# EAGLE design SolarCellX (EAGLE 9.2.2)
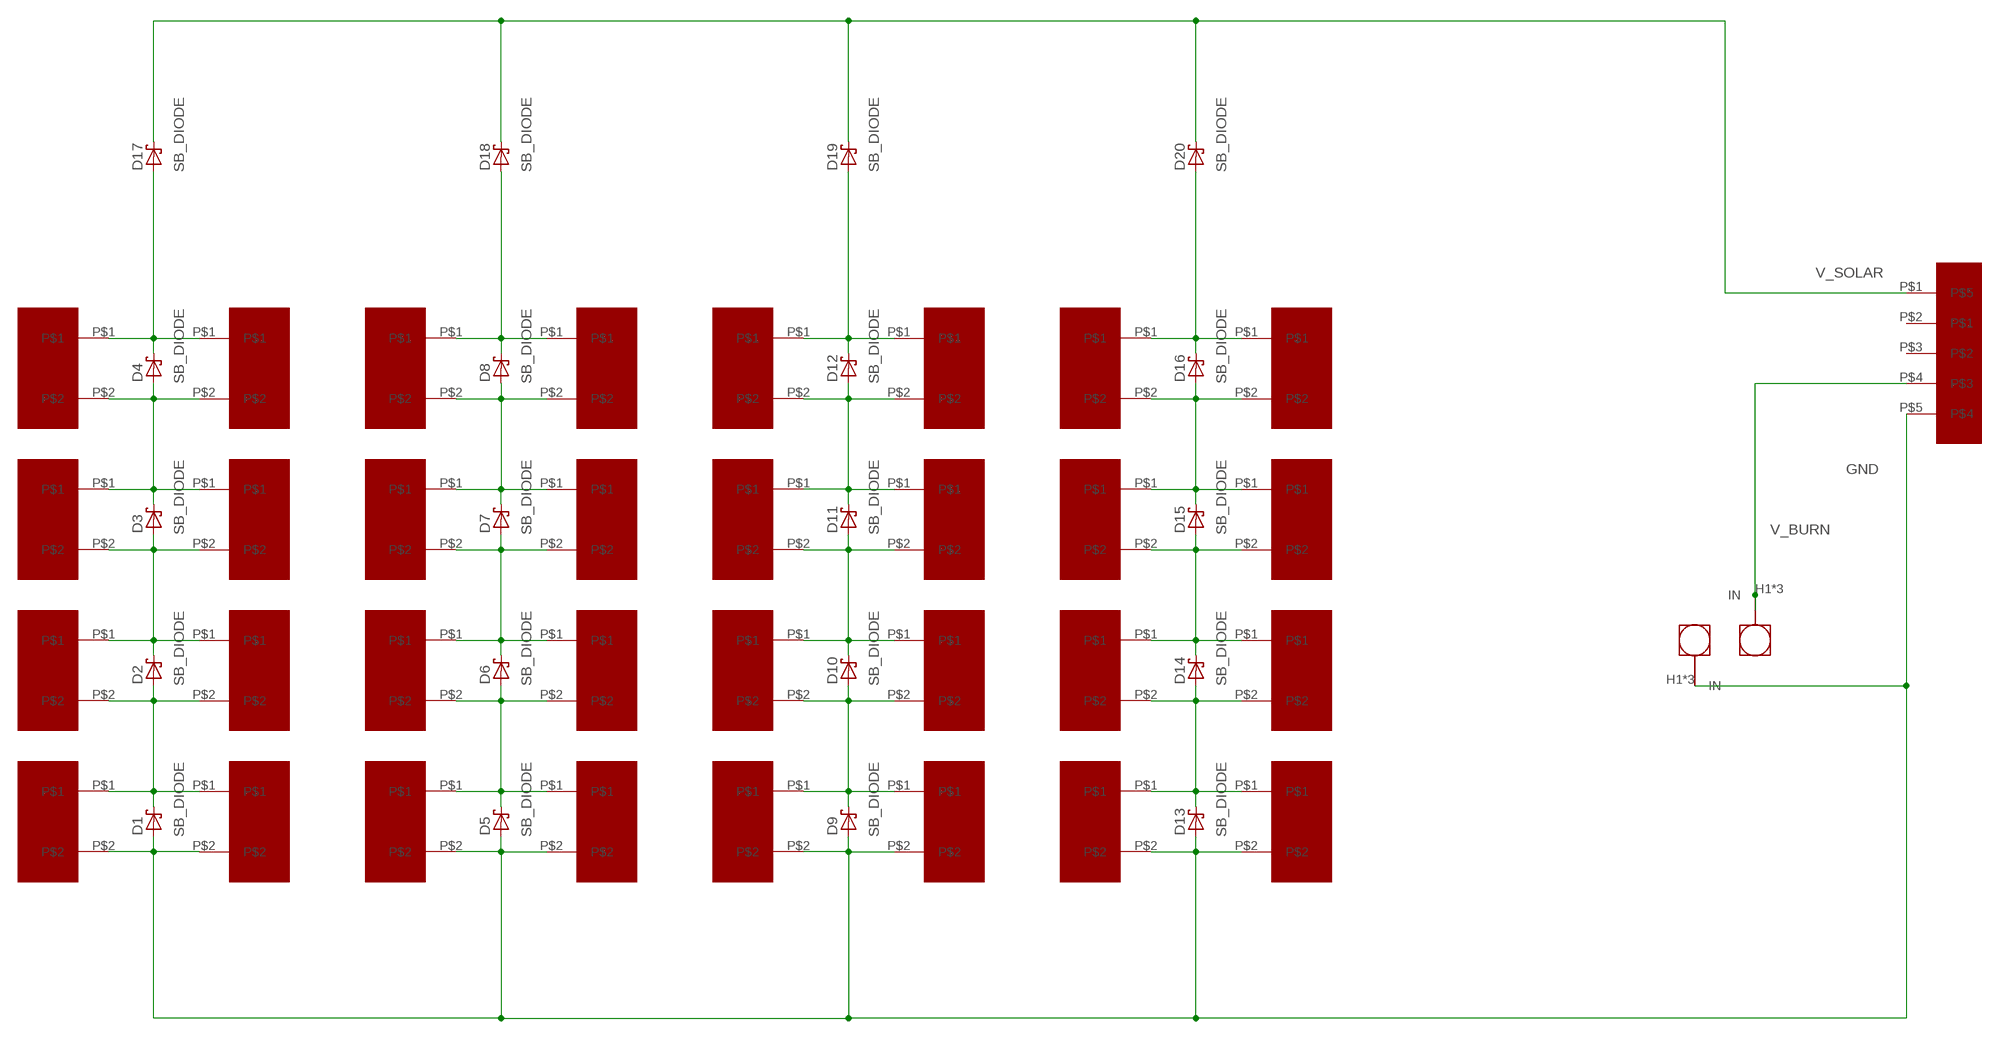
[diagram p0: schematic, sheet 1]

## Parts
11  KXOB22-04X3F  [KXOB22-04X3F]
12  KXOB22-04X3F  [KXOB22-04X3F]
13  KXOB22-04X3F  [KXOB22-04X3F]
14  KXOB22-04X3F  [KXOB22-04X3F]
15  KXOB22-04X3F  [KXOB22-04X3F]
16  KXOB22-04X3F  [KXOB22-04X3F]
17  KXOB22-04X3F  [KXOB22-04X3F]
18  KXOB22-04X3F  [KXOB22-04X3F]
21  KXOB22-04X3F  [KXOB22-04X3F]
22  KXOB22-04X3F  [KXOB22-04X3F]
23  KXOB22-04X3F  [KXOB22-04X3F]
24  KXOB22-04X3F  [KXOB22-04X3F]
25  KXOB22-04X3F  [KXOB22-04X3F]
26  KXOB22-04X3F  [KXOB22-04X3F]
27  KXOB22-04X3F  [KXOB22-04X3F]
28  KXOB22-04X3F  [KXOB22-04X3F]
31  KXOB22-04X3F  [KXOB22-04X3F]
32  KXOB22-04X3F  [KXOB22-04X3F]
33  KXOB22-04X3F  [KXOB22-04X3F]
34  KXOB22-04X3F  [KXOB22-04X3F]
35  KXOB22-04X3F  [KXOB22-04X3F]
36  KXOB22-04X3F  [KXOB22-04X3F]
37  KXOB22-04X3F  [KXOB22-04X3F]
38  KXOB22-04X3F  [KXOB22-04X3F]
41  KXOB22-04X3F  [KXOB22-04X3F]
42  KXOB22-04X3F  [KXOB22-04X3F]
43  KXOB22-04X3F  [KXOB22-04X3F]
44  KXOB22-04X3F  [KXOB22-04X3F]
45  KXOB22-04X3F  [KXOB22-04X3F]
46  KXOB22-04X3F  [KXOB22-04X3F]
47  KXOB22-04X3F  [KXOB22-04X3F]
48  KXOB22-04X3F  [KXOB22-04X3F]
D1  SB_DIODE  [SB_DIODE]
D2  SB_DIODE  [SB_DIODE]
D3  SB_DIODE  [SB_DIODE]
D4  SB_DIODE  [SB_DIODE]
D5  SB_DIODE  [SB_DIODE]
D6  SB_DIODE  [SB_DIODE]
D7  SB_DIODE  [SB_DIODE]
D8  SB_DIODE  [SB_DIODE]
D9  SB_DIODE  [SB_DIODE]
D10  SB_DIODE  [SB_DIODE]
D11  SB_DIODE  [SB_DIODE]
D12  SB_DIODE  [SB_DIODE]
D13  SB_DIODE  [SB_DIODE]
D14  SB_DIODE  [SB_DIODE]
D15  SB_DIODE  [SB_DIODE]
D16  SB_DIODE  [SB_DIODE]
D17  SB_DIODE  [SB_DIODE]
D18  SB_DIODE  [SB_DIODE]
D19  SB_DIODE  [SB_DIODE]
D20  SB_DIODE  [SB_DIODE]
U$33  B5B-EH-A(LF)(SN)  [B5B-EH-A(LF)(SN)]
U$34  BURNER  [BURNER]
U$35  BURNER  [BURNER]

## Nets
GND: 11.P$2 12.P$2 21.P$2 22.P$2 31.P$2 32.P$2 41.P$2 42.P$2 D1.POS D5.POS D9.POS D13.POS U$33.P$5 U$35.H1(IN) U$35.H2(IN) U$35.H3(IN)
N$2: 11.P$1 12.P$1 13.P$2 14.P$2 D1.NEG D2.POS
N$4: 13.P$1 14.P$1 15.P$2 16.P$2 D2.NEG D3.POS
N$6: 15.P$1 16.P$1 17.P$2 18.P$2 D3.NEG D4.POS
N$8: 17.P$1 18.P$1 D4.NEG D17.POS
N$9: 23.P$1 24.P$1 25.P$2 26.P$2 D6.NEG D7.POS
N$10: 21.P$1 22.P$1 23.P$2 24.P$2 D5.NEG D6.POS
N$14: 25.P$1 26.P$1 27.P$2 28.P$2 D7.NEG D8.POS
N$16: 27.P$1 28.P$1 D8.NEG D18.POS
N$18: 31.P$1 32.P$1 33.P$2 34.P$2 D9.NEG D10.POS
N$20: 33.P$1 34.P$1 35.P$2 36.P$2 D10.NEG D11.POS
N$22: 35.P$1 36.P$1 37.P$2 38.P$2 D11.NEG D12.POS
N$24: 37.P$1 38.P$1 D12.NEG D19.POS
N$26: 41.P$1 42.P$1 43.P$2 44.P$2 D13.NEG D14.POS
N$28: 43.P$1 44.P$1 45.P$2 46.P$2 D14.NEG D15.POS
N$30: 45.P$1 46.P$1 47.P$2 48.P$2 D15.NEG D16.POS
N$32: 47.P$1 48.P$1 D16.NEG D20.POS
V_BURN: U$33.P$4 U$34.H1(IN) U$34.H2(IN) U$34.H3(IN)
V_SOLAR: D17.NEG D18.NEG D19.NEG D20.NEG U$33.P$1
Unconnected: U$33.P$2 U$33.P$3

## Library data of the parts
11-18 21-28 31-38 41-48 = Solar:KXOB22-04X3F
D1-D20 = Solar:SB_DIODE
U$33 = Solar:B5B-EH-A(LF)(SN)
U$34 U$35 = Burner:BURNER

## Board
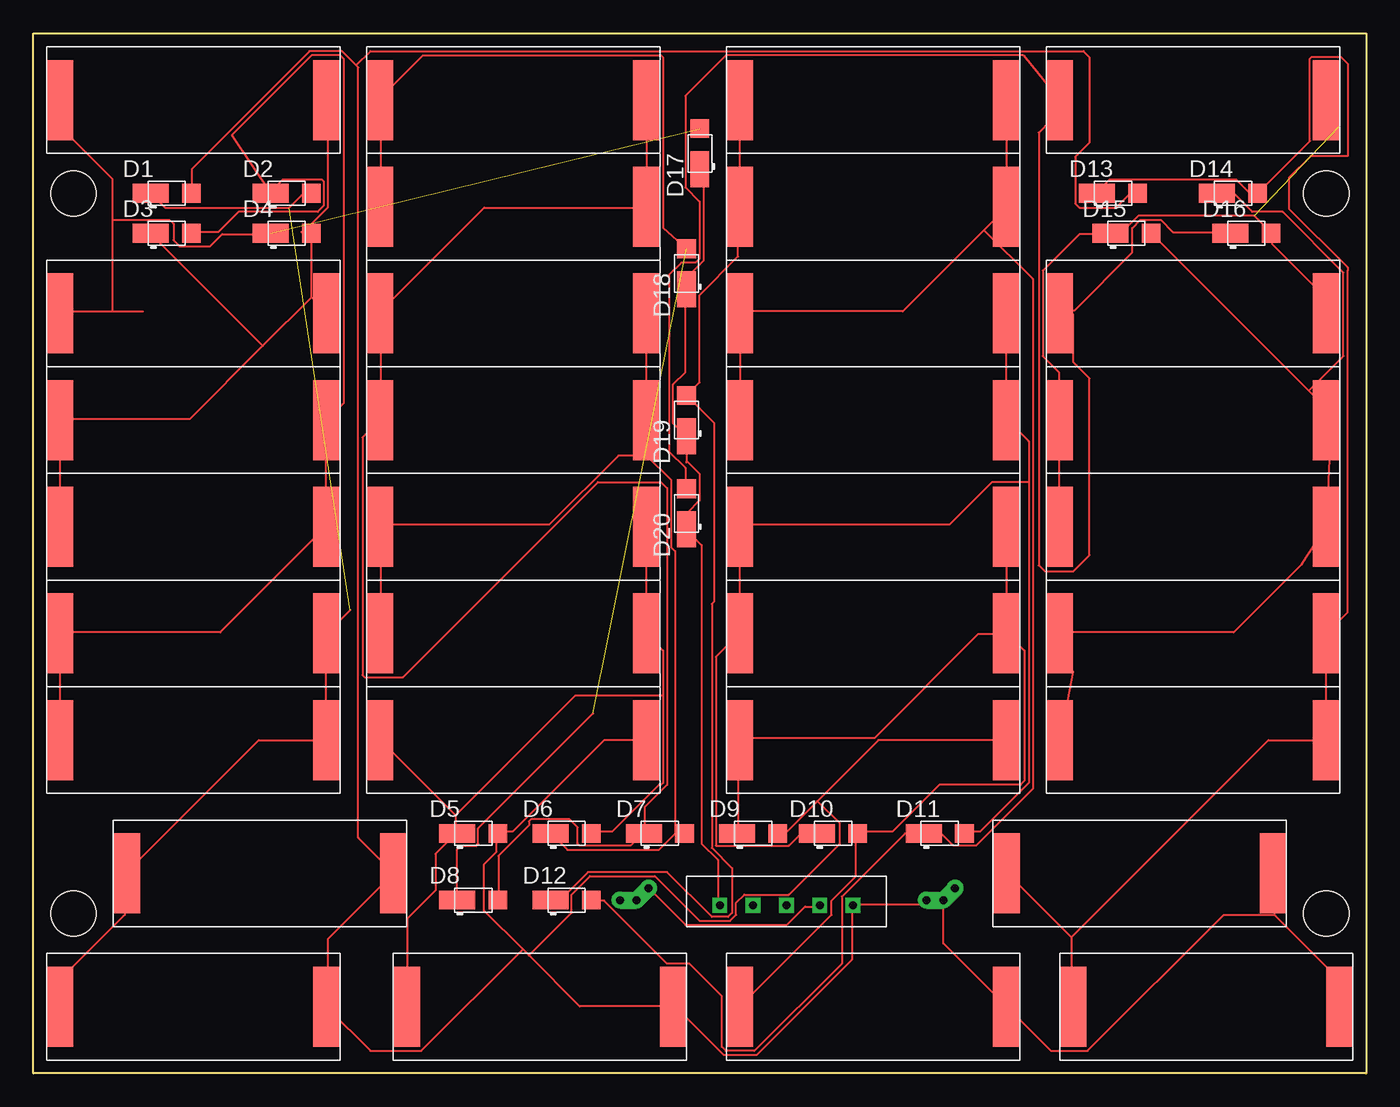
[diagram p1: board, top side]

Size 100 x 78 mm. Coordinates in mm from the lower left corner, seen from the top.
Outline: 0,0 0,78 100,78 100,0 0,0
Copper layers (1+2*15+16): Top 0.035mm / dielectric 1.5mm / Route2 0.035mm / dielectric 0.15mm / Route15 0.035mm / dielectric 0.2mm / Bottom 0.035mm
Design rules "default *": minimum track width 6mil, minimum drill 0.35mm, track to track 6mil, track to pad 6mil, pad to pad 6mil, via to via 6mil, smd to smd 6mil, copper to edge 40mil, drill to drill 6mil, minimum pad ring 10mil, minimum via ring 8mil, stop-mask expansion 4mil, vias tented up to drill 0mil, thermal gap 10mil
Holes 3.4 mm at 3,12 3,66 97,12 97,66

### Footprints (pad centres in the part's own frame; a part is rotated, then mirrored left to right if it is on the bottom)
KXOB22-04X3F = smd 2 x 6: P$1 1,4; P$2 21,4
SB_DIODE = smd 2.7 x 1.4: NEG -1.2,0 | smd 1.4 x 1.4: POS 1.85,0
B5B-EH-A(LF)(SN) = drill 0.6 square: P$1 2.5,1.6; P$2 5,1.6; P$3 7.5,1.6; P$4 10,1.6; P$5 12.5,1.6
BURNER = drill 0.6 pad 1.27 offset: H1 0,0; H2 1.27,0 | drill 0.6 pad 1.27: H3 2.159,0.889

### Placement (x,y rotation side)
11  1,1 0 top
12  6,11 0 top
13  1,21 0 top
14  1,29 0 top
15  1,37 0 top
16  1,45 0 top
17  1,53 0 top
18  1,69 0 top
21  27,1 0 top
22  25,21 0 top
23  25,29 0 top
24  25,37 0 top
25  25,45 0 top
26  25,53 0 top
27  25,61 0 top
28  25,69 0 top
31  52,1 0 top
32  52,21 0 top
33  52,29 0 top
34  52,37 0 top
35  52,45 0 top
36  52,53 0 top
37  52,61 0 top
38  52,69 0 top
41  77,1 0 top
42  72,11 0 top
43  76,21 0 top
44  76,29 0 top
45  76,37 0 top
46  76,45 0 top
47  76,53 0 top
48  76,69 0 top
D1  10,66 0 top
D2  19,66 0 top
D3  10,63 0 top
D4  19,63 0 top
D5  33,18 0 top
D6  40,18 0 top
D7  47,18 0 top
D8  33,13 0 top
D9  54,18 0 top
D10  60,18 0 top
D11  68,18 0 top
D12  40,13 0 top
D13  81,66 0 top
D14  90,66 0 top
D15  82,63 0 top
D16  91,63 0 top
D17  50,69 90 top
D18  49,60 90 top
D19  49,49 90 top
D20  49,42 90 top
U$33  49,11 0 top
U$34  44,13 0 top
U$35  67,13 0 top

### Tracks (layer width: path | path; a pad name or v marks a point on that pad's centre or on a via)
GND
  Top 0.152: 58.83,20.42 63.4,24.99 32.P$2 | 58.83,20.42 56.54,18.14 55.93,18.14 D9.POS | 93.12,11.89 97.99,7.01 97.99,5.03 41.P$2 | 93.12,11.89 93.12,14.94 42.P$2 | 22.P$2 45.87,24.99 42.82,24.99 35.97,18.14 34.9,18.14 D5.POS 34.75,17.98 34.75,16.61 33.83,15.7 33.83,12.19 36.73,9.3 | U$35.H2 68.12,13.11 67.06,13.11 U$35.H1 66.9,12.95 66.6,12.65 61.57,12.65 U$33.P$5 61.42,12.5 61.42,8.53 54.25,1.37 51.82,1.37 48.31,4.88 48.01,4.88 21.P$2 47.85,5.03 41,5.03 37.19,8.84 | U$35.H3 69.04,13.87 68.28,13.11 U$35.H2 | U$35.H2 68.28,12.95 68.28,9.75 73,5.03 31.P$2 73.15,4.88 76.35,1.68 79.1,1.68 89.31,11.89 93.12,11.89 | 37.19,8.84 36.73,9.3 | 58.83,20.42 60.5,18.75 60.5,17.22 56.69,13.41 53.34,13.41 52.73,12.8 52.73,11.89 52.27,11.43 49.99,11.43 46.63,14.78 41.76,14.78 40.39,13.41 40.39,12.04 37.19,8.84 | 24.23,75.59 24.38,75.44 24.38,17.68 26.98,15.09 12.P$2 26.98,14.94 22.1,10.06 22.1,5.03 11.P$2 22.1,4.88 25.3,1.68 29.11,1.68 36.73,9.3 | 24.23,75.59 23.16,76.66 20.73,76.66 11.89,67.82 11.89,66.14 D1.POS | 24.23,75.59 25.3,76.66 78.79,76.66 79.25,76.2 79.25,69.8 78.18,68.73 78.18,65.23 78.49,64.92 81.23,64.92 82.3,65.99 82.75,65.99 D13.POS
N$2  (1 unrouted)
  Top 0.152: 11.P$1 2.13,5.03 2.13,7.16 6.86,11.89 6.86,14.94 12.P$1 7.01,15.09 16.92,24.99 21.95,24.99 13.P$2 21.95,25.15 21.95,32.92 14.P$2 22.1,33.07 23.77,34.75 | 20.88,65.99 D2.POS 20.73,65.99 20.27,65.99 19.2,64.92 9.91,64.92 8.84,65.99 D1.NEG
N$4
  Top 0.152: 13.P$1 1.98,25.15 1.98,32.92 14.P$1 2.13,33.07 14.02,33.07 21.95,41 15.P$2 21.95,41.15 21.95,48.92 16.P$2 22.1,49.07 23.32,50.29 23.32,76.05 23.01,76.35 20.88,76.35 14.89,70.36 D2.NEG 17.83,66.14 18.75,67.06 21.64,67.06 21.79,66.9 21.79,65.08 21.34,64.62 15.39,64.62 13.87,63.09 11.89,63.09 D3.POS
N$6
  Top 0.152: 15.P$1 1.98,41.15 1.98,48.92 16.P$1 2.13,49.07 11.73,49.07 17.22,54.56 | 20.12,63.09 20.73,63.09 D4.POS | 20.88,58.22 21.95,57.15 17.P$2 | 21.95,70.71 21.95,73 18.P$2 21.95,70.71 | 20.88,58.22 17.22,54.56 | 20.88,58.22 20.88,62.94 D4.POS | 21.95,70.71 22.1,70.56 22.1,64.92 20.88,63.7 20.88,63.09 D4.POS | 17.22,54.56 8.84,62.94 D3.NEG
N$8  (1 unrouted)
  Top 0.152: 5.94,57.15 2.13,57.15 17.P$1 | 5.94,57.15 8.23,57.15 | 5.94,57.15 5.94,64.01 | 5.94,64.01 5.94,67.06 2.13,70.87 2.13,73 18.P$1 | 5.94,64.01 10.21,64.01 10.52,63.7 10.52,62.48 10.97,62.03 13.26,62.03 14.17,62.94 17.68,62.94 D4.NEG
N$9
  Top 0.152: 23.P$1 26.06,33.07 26.06,41 24.P$1 26.06,41.15 38.71,41.15 43.89,46.33 46.02,46.33 | 48.16,17.98 48.77,17.98 D7.POS 48.16,17.98 | 48.16,17.98 46.94,16.76 40.08,16.76 38.86,17.98 D6.NEG | 46.02,46.33 46.02,48.92 25.P$2 | 26.P$2 46.02,57 46.02,49.07 25.P$2 | 48.16,17.98 48.16,39.17 47.85,39.47 47.85,44.5 46.02,46.33 | 46.02,46.33 25.P$2
N$10
  Top 0.152: 47.24,28.35 47.24,31.7 46.02,32.92 23.P$2 46.02,33.07 46.02,41 24.P$2 | 47.24,28.35 47.24,21.79 47.09,21.64 46.94,21.64 43.43,18.14 41.91,18.14 D6.POS | 31.7,19.36 31.7,18.14 D5.NEG 31.7,17.98 30.18,16.46 30.18,13.72 28.04,11.58 28.04,5.03 21.P$1 | 31.7,19.36 26.06,24.99 22.P$1 | 47.24,28.35 40.69,28.35 31.7,19.36
N$14
  Top 0.152: 28.P$2 46.02,73 46.02,65.08 27.P$2 45.87,64.92 33.83,64.92 26.06,57.15 26.P$1 26.06,57 26.06,49.07 25.P$1 25.91,48.92 24.69,47.7 24.69,29.87 24.84,29.72 27.74,29.72 42.37,44.35 47.09,44.35 47.55,43.89 47.55,21.64 45.87,19.96 45.87,18.14 D7.NEG 45.72,17.98 44.81,17.07 41,17.07 40.84,17.22 40.84,18.44 40.23,19.05 37.34,19.05 37.19,18.9 37.19,18.59 34.9,16.31 34.9,13.11 D8.POS
N$16  (1 unrouted)
  Top 0.152: D18.POS 47.24,63.4 47.24,76.2 47.09,76.35 29.26,76.35 26.06,73.15 28.P$1 26.06,73 26.06,65.08 27.P$1 | D8.NEG 31.8,16.8 32.07,17.07 33.24,17.07 33.38,17.2 33.38,18.38 42,27
N$18
  Top 0.152: 31.P$1 53.03,5.03 59.89,11.89 59.89,12.95 61.72,14.78 61.72,17.98 D10.POS 61.87,18.14 64.47,18.14 67.97,21.64 74.07,21.64 74.37,21.95 74.37,31.7 73.15,32.92 33.P$2 | D9.NEG 52.88,18.14 52.88,24.99 32.P$1 53.03,25.15 63.09,25.15 70.87,32.92 73,32.92 33.P$2 | 33.P$2 73,33.07 34.P$2
N$20
  Top 0.152: D10.NEG 58.67,17.98 57.61,17.98 56.69,17.07 51.21,17.07 51.21,31.24 52.88,32.92 33.P$1 53.03,33.07 53.03,41 34.P$1 53.03,41.15 68.73,41.15 71.93,44.35 74.68,44.35 | 74.68,44.35 74.68,47.4 73.15,48.92 35.P$2 73,49.07 36.P$2 | 74.68,44.35 74.68,21.79 71.02,18.14 69.95,18.14 D11.POS
N$22
  Top 0.152: D12.POS 41.91,12.95 42.82,12.95 47.55,8.23 49.23,8.23 51.66,5.79 51.66,1.98 51.97,1.68 54.1,1.68 60.66,8.23 60.66,13.26 65.38,17.98 66.75,17.98 D11.NEG 66.9,17.98 68.12,17.98 69.04,17.07 70.71,17.07 74.98,21.34 74.98,59.59 71.32,63.25 | 35.P$1 53.03,49.07 53.03,57 36.P$1 53.03,57.15 65.23,57.15 71.32,63.25 | 38.P$2 73,65.08 37.P$2 73,64.92 71.32,63.25 | 38.P$2
N$24
  Top 0.152: 52.88,64.01 52.88,64.92 37.P$1 | D12.NEG 38.86,13.11 39.62,13.11 41.6,15.09 47.55,15.09 50.9,11.73 52.12,11.73 52.43,12.04 52.43,15.39 50.9,16.92 50.9,35.2 51.05,35.36 51.05,48.8 D19.POS 49.07,50.9 49.99,51.82 49.99,58.37 52.88,61.27 52.88,64.01 | 38.P$1 53.03,73 53.03,65.08 37.P$1 | 52.88,64.01 37.P$1
N$26
  Top 0.152: 77.88,10.21 77.88,5.03 41.P$1 | 77.88,10.21 73.15,14.94 42.P$1 | 77.88,10.21 92.66,24.99 43.P$2 44.P$2 97.08,33.07 98.6,34.59 98.6,60 98.6,60.2 98.6,60.45 94.21,64.84 94.21,67.16 95.84,68.79 98.6,68.79 98.6,75.72 98.09,76.23 95.91,76.23 95.77,76.09 95.77,69.92 D14.POS | D14.POS 91.75,66.14 91.14,66.14 90.22,67.06 80.77,67.06 79.86,66.14 D13.NEG | 91.9,65.99 D14.POS
N$28
  Top 0.152: 43.P$1 78.01,30.13 44.P$1 77.03,33.07 90.07,33.07 95.17,38.17 45.P$2 97.39,49.52 97.07,49.84 | 97.07,49.84 95.71,51.21 | 95.71,51.21 83.97,62.94 D15.POS | 97.07,49.84 46.P$2 | 95.71,51.21 98.3,53.8 98.3,60.05 93.73,64.62 91.44,64.62 90.07,65.99 88.85,65.99 D14.NEG
N$30  (1 unrouted)
  Top 0.152: 47.P$2 96.95,58.2 92.96,62.18 92.96,62.94 D16.POS 92.81,63.09 91.59,64.31 82.91,64.31 81.69,63.09 80.92,63.09 D15.NEG | 97.99,71.02 97.99,72.94 48.P$2 | 79.55,62.94 80.77,62.94 D15.NEG | 45.P$1 76.96,41.15 76.96,48.92 46.P$1 76.96,49.07 76.96,52.58 75.74,53.8 75.74,60.2 78.49,62.94 79.55,62.94 | 79.55,62.94 D15.NEG
N$32
  Top 0.152: D16.NEG 89.76,63.09 85.5,63.09 84.58,64.01 83.06,64.01 82.45,63.4 82.45,61.57 78.09,57.21 47.P$1 78.03,56.91 78.03,53.34 79.25,52.12 79.25,38.86 78.03,37.64 75.89,37.64 75.44,38.1 75.44,70.56 76.35,71.48 | 48.P$1 74.27,76.35 51.97,76.35 48.92,73.3 48.92,66.45 49.99,65.38 49.99,61.11 49.68,60.81 48.62,60.81 47.7,59.89 47.7,46.63 48.92,45.41 48.92,43.89 D20.POS | 76.35,71.48 77,72.12 48.P$1 | 76.35,71.48 48.P$1
V_BURN
  Top 0.152: U$34.H2 45.26,12.95 44.04,12.95 U$34.H1 45.41,13.11 46.18,13.87 | 46.18,13.87 48.92,11.12 56.54,11.12 57.91,12.5 58.98,12.5 U$33.P$4 | 46.18,13.87 U$34.H3
V_SOLAR
  Top 0.152: U$33.P$1 51.36,12.65 51.36,16 50.14,17.22 50.14,39.62 49.07,40.69 D20.NEG 49.07,40.84 49.07,42.06 49.99,42.98 49.99,44.96 49.07,45.87 49,45.87 | 50.14,67.73 D17.NEG 50.14,67.67 50.29,67.51 50.29,60.96 49.07,59.74 49.07,58.83 D18.NEG 48.92,58.67 48.92,52.58 48.01,51.66 48.01,48.77 48.92,47.85 D19.NEG 49,45.87 | 49,45.87 49,45.8